# EAGLE design mbhp_core_stm32_v2a (EAGLE 5.00)
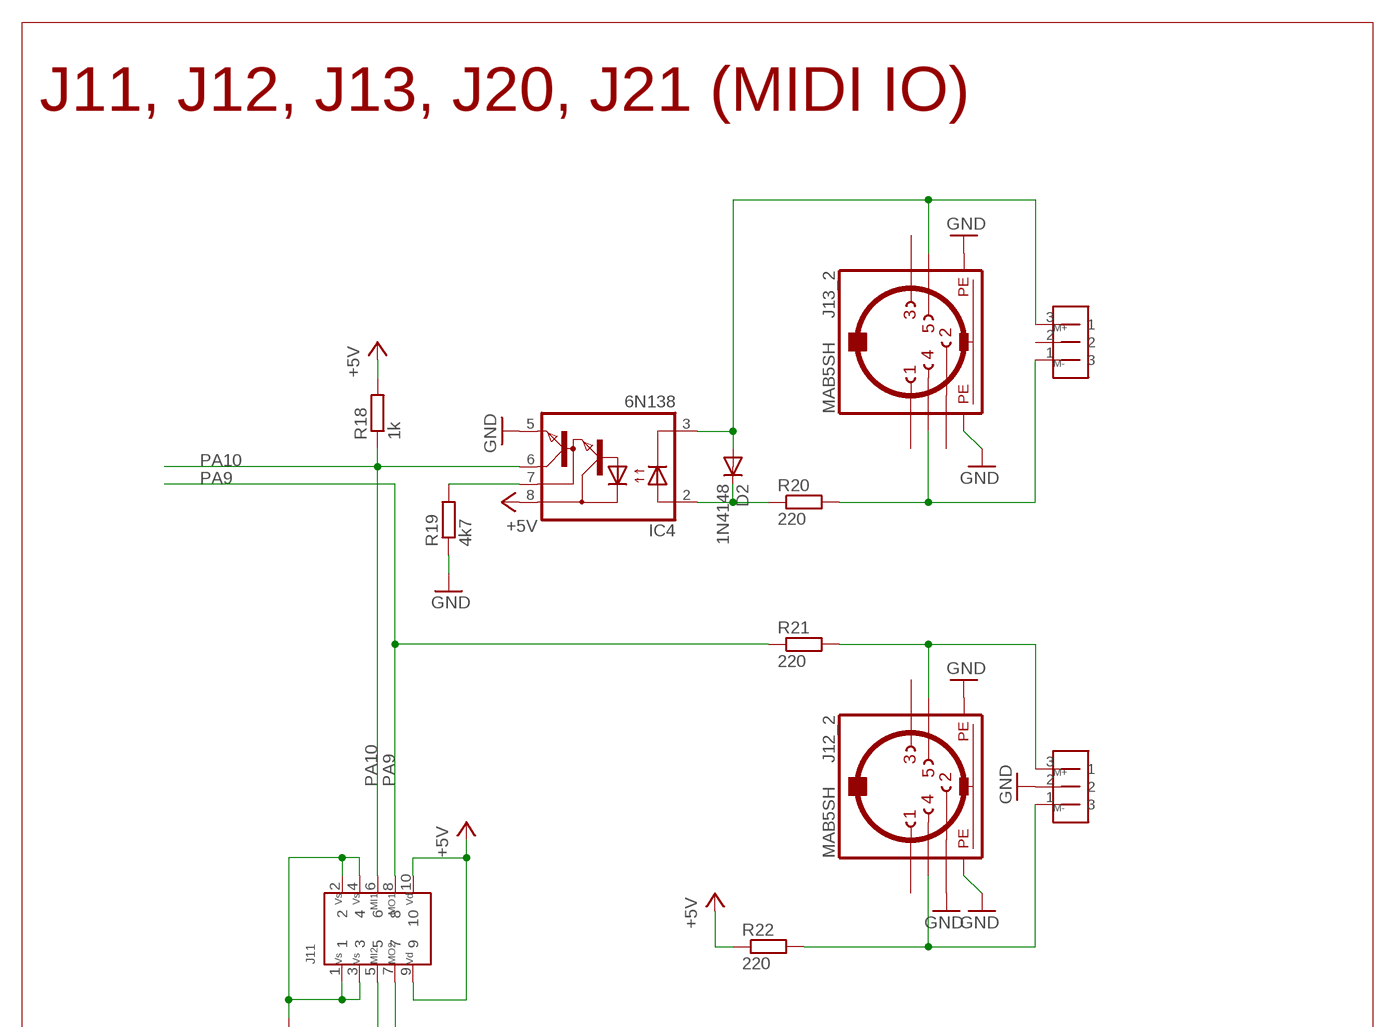
[diagram p0: schematic, sheet 1, part 1 of 3]
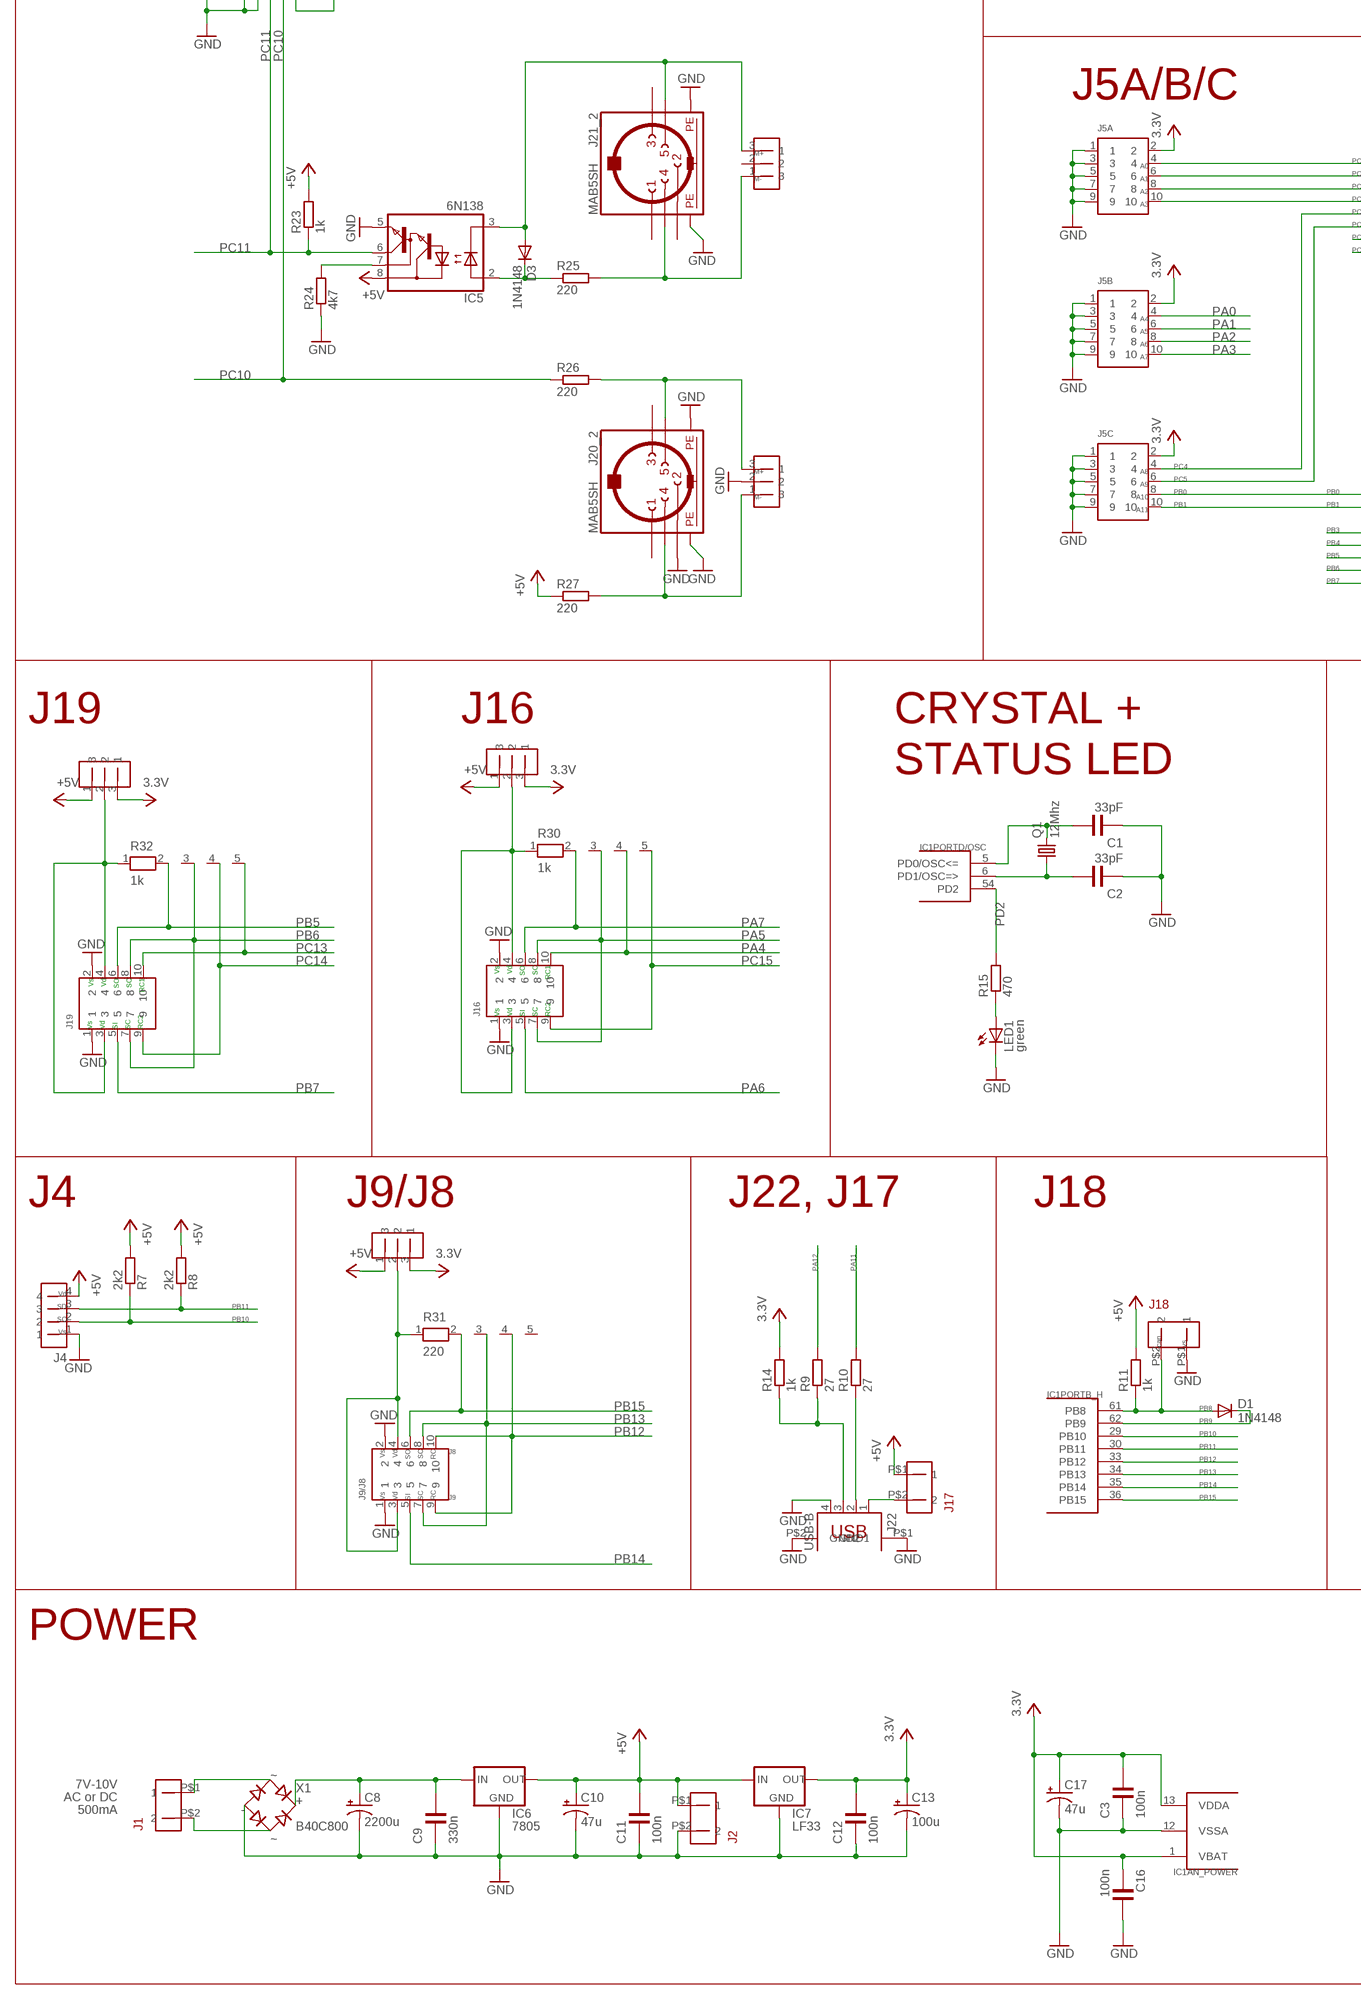
[diagram p1: schematic, sheet 1, part 2 of 3]
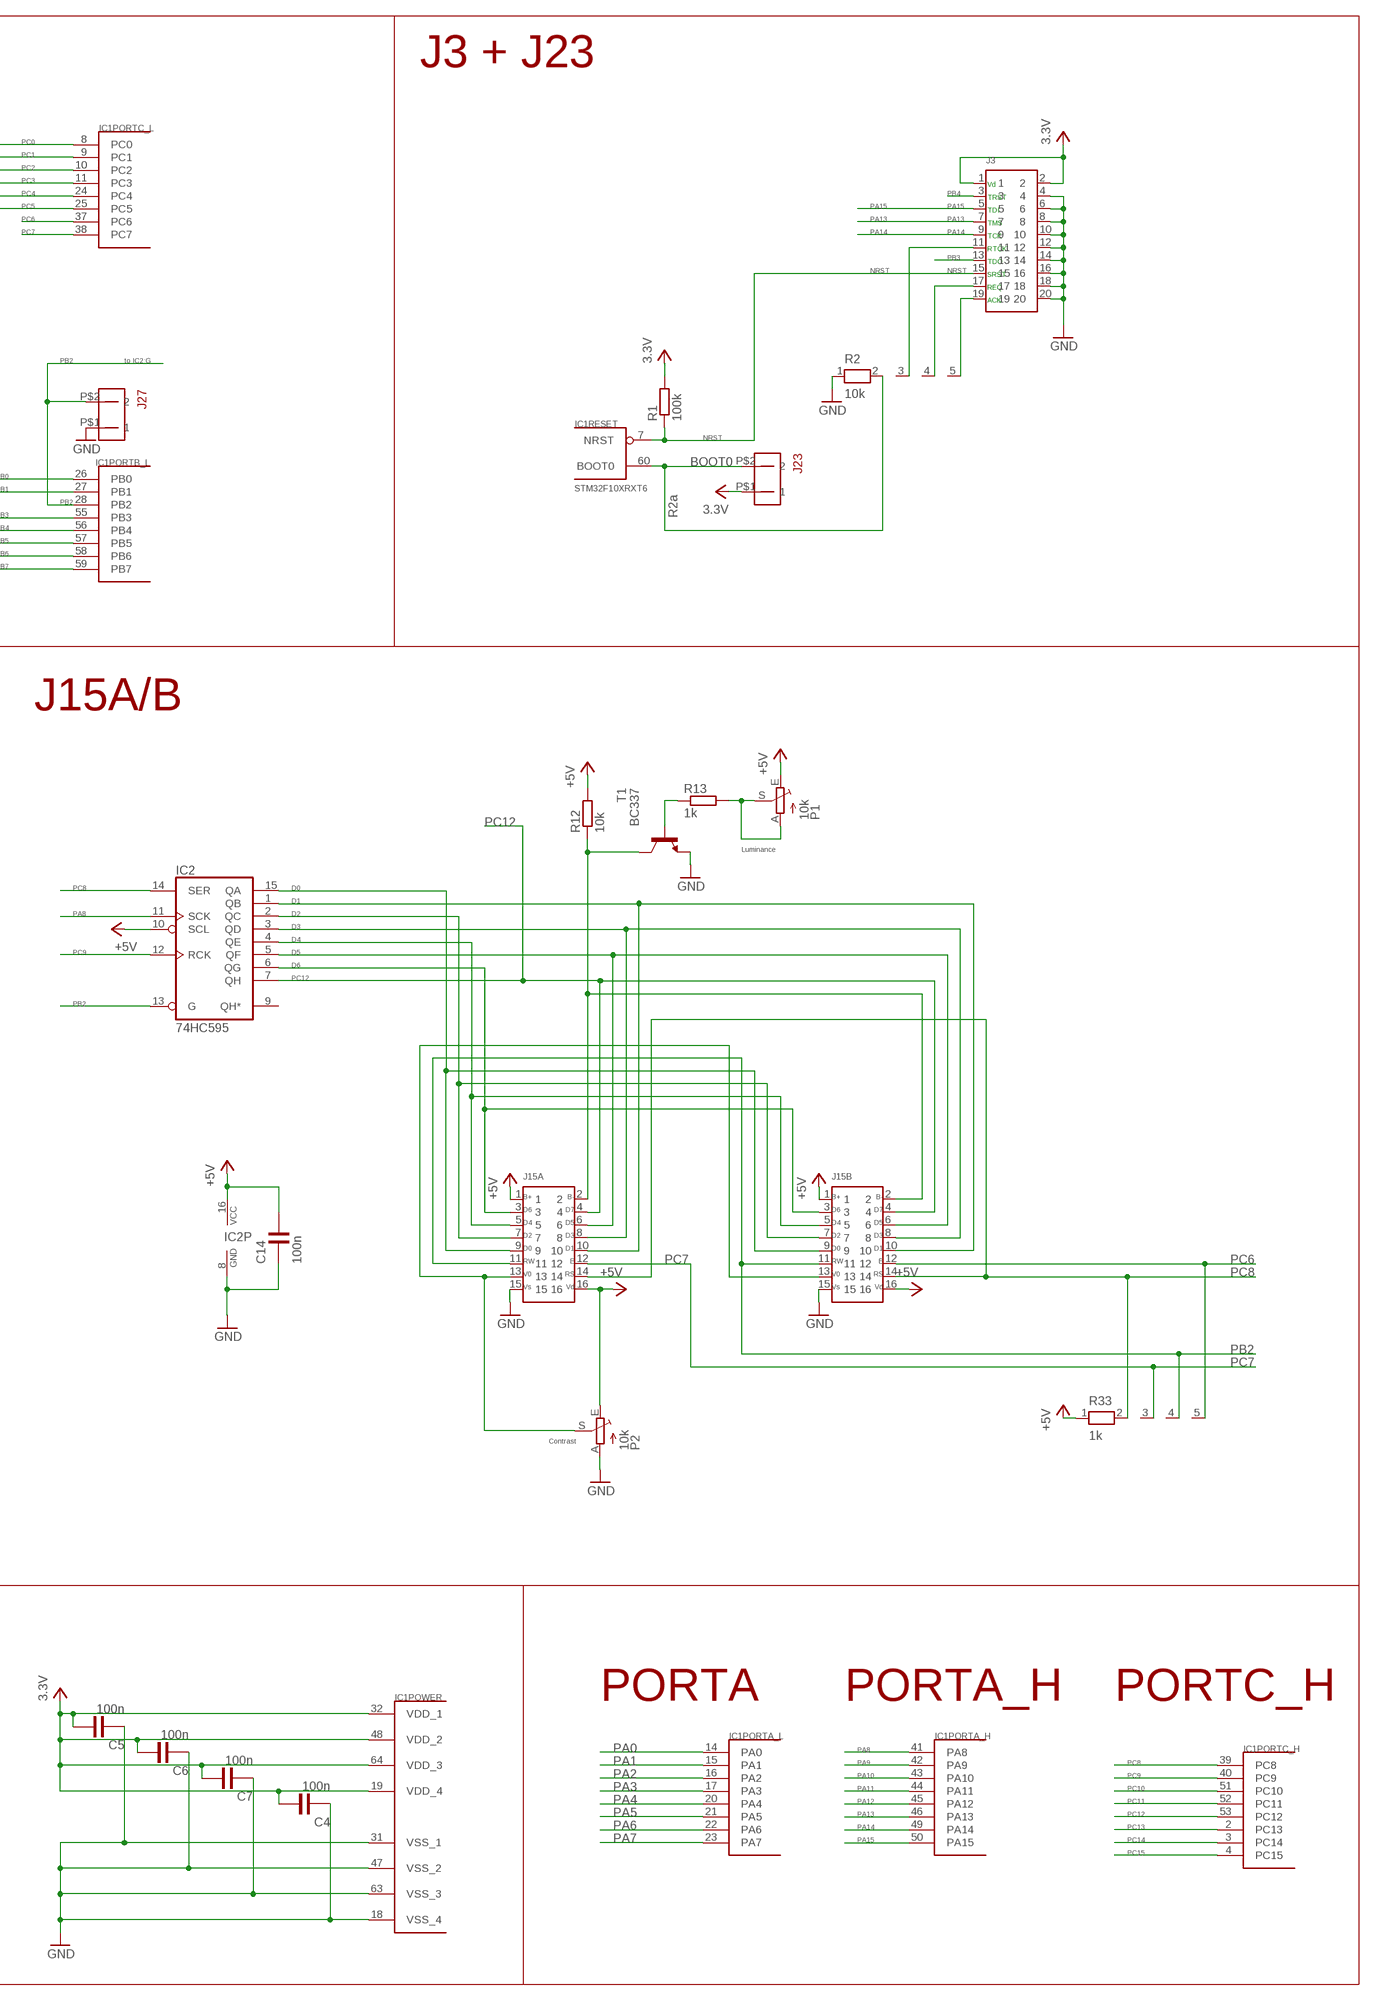
[diagram p2: schematic, sheet 1, part 3 of 3]

## Parts
C1  33pF  C-EU025-024X044  [C025-024X044]
C2  33pF  C-EU025-024X044  [C025-024X044]
C3  100n  C-EU025-025X050  [C025-025X050]
C4  100n  C-EU025-025X050  [C025-025X050]
C5  100n  C-EU025-025X050  [C025-025X050]
C6  100n  C-EU025-025X050  [C025-025X050]
C7  100n  C-EU025-025X050  [C025-025X050]
C8  2200u  CPOL-USE5-13  [E5-13]
C9  330n  C-EU050-025X075  [C050-025X075]
C10  47u  CPOL-USE2.5-7  [E2,5-7]
C11  100n  C-EU025-025X050  [C025-025X050]
C12  100n  C-EU025-025X050  [C025-025X050]
C13  100u  CPOL-USE2.5-7  [E2,5-7]
C14  100n  C-EU025-025X050  [C025-025X050]
C16  100n  C-EU025-025X050  [C025-025X050]
C17  47u  CPOL-USE2.5-6  [E2,5-6]
D1  1N4148  1N4148DIODE_2.5  [D-2.5]
D2  1N4148  1N4148D7  [DIODE_7]
D3  1N4148  1N4148D7  [DIODE_7]
IC1  STM32F10XRXT6  [TQFP64]
IC2  74HC595  74HCT595N  [DIL16]
IC4  6N138  [DIL08]
IC5  6N138  [DIL08]
IC6  7805  78XXS  [78XXS]
IC7  LF33  78XXS  [78XXS]
J1  HEADER1X2  [HEADER1X2]
J2  HEADER1X2  [HEADER1X2]
J3  HEADER2X10  [HEADER2X10]
J4  HEADER1X4  [HEADER1X4]
J5A  HEADER2X5  [HEADER2X5]
J5B  HEADER2X5  [HEADER2X5]
J5C  HEADER2X5  [HEADER2X5]
J9/J8  HEADER2X5  [HEADER2X5]
J11  HEADER2X5  [HEADER2X5]
J12  HEADER1X3  [HEADER1X3]
J12_2  MAB5SH  [MAB5SH]
J13  HEADER1X3  [HEADER1X3]
J13_2  MAB5SH  [MAB5SH]
J15A  HEADER2X8  [HEADER2X8]
J15B  HEADER2X8  [HEADER2X8]
J16  HEADER2X5  [HEADER2X5]
J17  HEADER1X2  [HEADER1X2]
J18  HEADER1X2  [HEADER1X2]
J19  HEADER2X5-SMALL  [HEADER2X5-NO]
J20  HEADER1X3  [HEADER1X3]
J20_2  MAB5SH  [MAB5SH]
J21  HEADER1X3  [HEADER1X3]
J21_2  MAB5SH  [MAB5SH]
J22  USB-B  [PN61729]
J23  HEADER1X2  [HEADER1X2]
J24  HEADER1X3  [HEADER1X3]
J25  HEADER1X3  [HEADER1X3]
J26  HEADER1X3  [HEADER1X3]
J27  HEADER1X2  [HEADER1X2]
LED1  green  LED3MM  [LED3MM]
P1  10k  TRIM_EU-CA6V  [CA6V]
P2  10k  TRIM_EU-CA6V  [CA6V]
Q1  12Mhz  CRYTALHC49S  [HC49/S]
R1  100k  0207/7  [0207/7]
R2  10k  RN04  [RN-5]
R7  2k2  0207/70207/2V  [0207/2V]
R8  2k2  0207/70207/2V  [0207/2V]
R9  27  0207/7  [0207/7]
R10  27  0207/7  [0207/7]
R11  1k  0207/70207/2V  [0207/2V]
R12  10k  0207/70207/2V  [0207/2V]
R13  1k  0207/70207/2V  [0207/2V]
R14  1k  0207/7  [0207/7]
R15  470  0207/70207/2V  [0207/2V]
R18  1k  0207/7  [0207/7]
R19  4k7  0207/7  [0207/7]
R20  220  0207/7  [0207/7]
R21  220  0207/7  [0207/7]
R22  220  0207/7  [0207/7]
R23  1k  0207/7  [0207/7]
R24  4k7  0207/7  [0207/7]
R25  220  0207/7  [0207/7]
R26  220  0207/7  [0207/7]
R27  220  0207/7  [0207/7]
R30  1k  RN04  [RN-5]
R31  220  RN04  [RN-5]
R32  1k  RN04  [RN-5]
R33  1k  RN04  [RN-5]
T1  BC337  [TO92]
X1  B40C800  RB1A  [RB1A]

## Nets
+3.3V: C3.1 C4.1 C5.1 C6.1 C7.1 C12.1 C13.+ C16.2 C17.+ IC1.1(AN_POWER:VBAT) IC1.13(AN_POWER:VDDA) IC1.19(POWER:VDD_4) IC1.32(POWER:VDD_1) IC1.48(POWER:VDD_2) IC1.64(POWER:VDD_3) IC7.OUT J3.1 J3.2 J5A.2 J5B.2 J5C.2 J23.P$1 J24.3 J25.3 J26.3 R1.2 R14.2 ; supply symbol labelled 3.3V
+5V: C10.+ C11.1 C14.1 IC2.10(SCL) IC2.16(VCC) IC4.8(VCC) IC5.8(VCC) IC6.OUT IC7.IN J2.P$1 J4.4 J11.9 J11.10 J15A.1 J15A.16 J15B.1 J15B.16 J17.P$1 J24.1 J25.1 J26.1 P1.E P2.E R7.2 R8.2 R11.2 R12.2 R18.2 R22.1 R23.2 R27.1 R33.1
B-: J15A.2 J15B.2 R12.1 T1.3(C)
BOOT0: IC1.60(RESET:BOOT0) J23.P$2 R2.2
D0: IC2.15(QA) J15A.9 J15B.9
D1: IC2.1(QB) J15A.10 J15B.10
D2: IC2.2(QC) J15A.7 J15B.7
D3: IC2.3(QD) J15A.8 J15B.8
D4: IC2.4(QE) J15A.5 J15B.5
D5: IC2.5(QF) J15A.6 J15B.6
D6: IC2.6(QG) J15A.3 J15B.3
GND: C1.2 C2.2 C3.2 C4.2 C5.2 C6.2 C7.2 C8.- C9.2 C10.- C11.2 C12.2 C13.- C14.2 C16.1 C17.- IC1.12(AN_POWER:VSSA) IC1.18(POWER:VSS_4) IC1.31(POWER:VSS_1) IC1.47(POWER:VSS_2) IC1.63(POWER:VSS_3) IC2.8(GND) IC4.5(GND) IC5.5(GND) IC6.GND IC7.GND J2.P$2 J3.4 J3.6 J3.8 J3.10 J3.12 J3.14 J3.16 J3.18 J3.20 J4.1 J5A.1 J5A.3 J5A.5 J5A.7 J5A.9 J5B.1 J5B.3 J5B.5 J5B.7 J5B.9 J5C.1 J5C.3 J5C.5 J5C.7 J5C.9 J9/J8.1 J9/J8.2 J11.1 J11.2 J11.3 J11.4 J12.2 J12_2.2 J12_2.PE J12_2.PE@(PE) J13_2.PE J13_2.PE@(PE) J15A.15 J15B.15 J16.1 J16.2 J18.P$1 J19.1 J19.2 J20.2 J20_2.2 J20_2.PE J20_2.PE@(PE) J21_2.PE J21_2.PE@(PE) J22.4 J22.P$1(GND1) J22.P$2(GND2) J27.P$1 LED1.K(C) P2.A R2.1 R19.1 R24.1 T1.1(E) X1.-
N$1: LED1.A R15.1
N$2: J16.3 J16.4 J24.2 R30.1
N$3: J19.3 J19.4 J26.2 R32.1
N$4: D2.P$1(A) IC4.3(C) J13.3 J13_2.5
N$5: J9/J8.3 J9/J8.4 J25.2 R31.1
N$7: C8.+ C9.1 IC6.IN X1.+
N$17: J17.P$2 J22.1
N$31: J1.P$1 X1.AC1
N$35: J3.19 R2.5
N$56: J12.1 J12_2.4 R22.2
N$57: J12.3 J12_2.5 R21.2
N$59: IC4.7(VB) R19.2
N$60: J13.1 J13_2.4 R20.2
N$61: D2.P$2(C) IC4.2(A) R20.1
N$62: J1.P$2 X1.AC2
N$64: J20.1 J20_2.4 R27.2
N$65: J20.3 J20_2.5 R26.2
N$67: IC5.7(VB) R24.2
N$68: D3.P$2(C) IC5.2(A) R25.1
N$69: D3.P$1(A) IC5.3(C) J21.3 J21_2.5
N$70: J21.1 J21_2.4 R25.2
N$72: R13.1 T1.2(B)
N$73: P1.A P1.S R13.2
N$74: J15A.13 J15B.13 P2.S
N$83: J3.17 R2.4
N$84: J3.11 R2.3
NRST: IC1.7(RESET:NRST) J3.15 R1.1
PA0: IC1.14(PORTA_L:PA0) J5B.4
PA1: IC1.15(PORTA_L:PA1) J5B.6
PA2: IC1.16(PORTA_L:PA2) J5B.8
PA3: IC1.17(PORTA_L:PA3) J5B.10
PA4: IC1.20(PORTA_L:PA4) J16.10 R30.4
PA5: IC1.21(PORTA_L:PA5) J16.7 J16.8 R30.3
PA6: IC1.22(PORTA_L:PA6) J16.5
PA7: IC1.23(PORTA_L:PA7) J16.6 R30.2
PA8: IC1.41(PORTA_H:PA8) IC2.11(SCK)
PA9: IC1.42(PORTA_H:PA9) J11.8 R21.1
PA10: IC1.43(PORTA_H:PA10) IC4.6(VO) J11.6 R18.1
PA11: IC1.44(PORTA_H:PA11) R10.2
PA12: IC1.45(PORTA_H:PA12) R9.2
PA13: IC1.46(PORTA_H:PA13) J3.7
PA14: IC1.49(PORTA_H:PA14) J3.9
PA15: IC1.50(PORTA_H:PA15) J3.5
PB0: IC1.26(PORTB_L:PB0) J5C.8
PB1: IC1.27(PORTB_L:PB1) J5C.10
PB2: IC1.28(PORTB_L:PB2) IC2.13(G) J15A.11 J15B.11 J27.P$2 R33.4
PB3: IC1.55(PORTB_L:PB3) J3.13
PB4: IC1.56(PORTB_L:PB4) J3.3
PB5: IC1.57(PORTB_L:PB5) J19.6 R32.2
PB6: IC1.58(PORTB_L:PB6) J19.7 J19.8 R32.3
PB7: IC1.59(PORTB_L:PB7) J19.5
PB8: D1.A IC1.61(PORTB_H:PB8) J18.P$2 R11.1
PB9: D1.C IC1.62(PORTB_H:PB9)
PB10: IC1.29(PORTB_H:PB10) J4.2 R7.1
PB11: IC1.30(PORTB_H:PB11) J4.3 R8.1
PB12: IC1.33(PORTB_H:PB12) J9/J8.9 J9/J8.10 R31.4
PB13: IC1.34(PORTB_H:PB13) J9/J8.7 J9/J8.8 R31.3
PB14: IC1.35(PORTB_H:PB14) J9/J8.5
PB15: IC1.36(PORTB_H:PB15) J9/J8.6 R31.2
PC0: IC1.8(PORTC_L:PC0) J5A.4
PC1: IC1.9(PORTC_L:PC1) J5A.6
PC2: IC1.10(PORTC_L:PC2) J5A.8
PC3: IC1.11(PORTC_L:PC3) J5A.10
PC4: IC1.24(PORTC_L:PC4) J5C.4
PC5: IC1.25(PORTC_L:PC5) J5C.6
PC6: IC1.37(PORTC_L:PC6) J15B.12 R33.5
PC7: IC1.38(PORTC_L:PC7) J15A.12 R33.3
PC8: IC1.39(PORTC_H:PC8) IC2.14(SER) J15A.14 J15B.14 R33.2
PC9: IC1.40(PORTC_H:PC9) IC2.12(RCK)
PC10: IC1.51(PORTC_H:PC10) J11.7 R26.1
PC11: IC1.52(PORTC_H:PC11) IC5.6(VO) J11.5 R23.1
PC12: IC1.53(PORTC_H:PC12) IC2.7(QH) J15A.4 J15B.4
PC13: IC1.2(PORTC_H:PC13) J19.10 R32.5
PC14: IC1.3(PORTC_H:PC14) J19.9 R32.4
PC15: IC1.4(PORTC_H:PC15) J16.9 R30.5
PD0: C1.1 IC1.5(PORTD/OSC:PD0/OSC<=) Q1.2
PD1: C2.1 IC1.6(PORTD/OSC:PD1/OSC=>) Q1.1
PD2: IC1.54(PORTD/OSC:PD2) R15.2
USB1: J22.2 R10.1
USB2: J22.3 R9.1 R14.1
Unconnected: IC2.9(QH*) J12_2.1 J12_2.3 J13.2 J13_2.1 J13_2.2 J13_2.3 J20_2.1 J20_2.3 J21.2 J21_2.1 J21_2.2 J21_2.3 R31.5

## Notes on the sheet
- J11, J12, J13, J20, J21 (MIDI IO)
- M+
- M-
- M+
- M-
- Vs | Vs | MI1 | MO1 | Vd
- Vs | Vs | MI2 | MO2 | Vd
- J5A/B/C | J3 + J23
- M+
- A0
- M- | A1
- A2
- A3
- Vd
- TRST
- TDI
- TMS
- TCK
- RTCK
- TDO
- SRST
- REQ
- A4
- ACK
- A5
- A6
- A7
- to IC2:G
- M+ | A8
- A9
- M- | A10
- A11
- R2a
- J19 | J16 | CRYSTAL + | J15A/B
- STATUS LED
- Luminance
- Vs | Vd | SO | SC | RC1
- Vs | Vd | SO | SC | RC1
- Vs | Vd | SI | SC | RC2
- Vs | Vd | SI | SC | RC2
- B- | B-
- J4 | J9/J8 | J22, J17 | J18 | B+ | B+
- D7 | D7
- D6 | D6
- D5 | D5
- D4 | D4
- D3 | D3
- D2 | D2
- D1 | D1
- D0 | D0
- E | E
- RW | RW
- RS | RS
- V0 | V0
- Vd | Vd
- Vd | Vs | Vs
- SD
- SC
- Vs
- can | vs
- Vs | Vd | SO | SC | RC | Contrast
- J8
- Vs | Vd | SI | SC | RC | J9
- POWER
- PORTA | PORTA_H | PORTC_H
- 7V-10V | ~
- AC or DC
- 500mA | - | +
- ~

## Library data of the parts
C1-C7 C9 C11 C12 C14 C16 = rcl:C-EU: CAPACITOR, European symbol
C8 C10 C13 C17 = rcl:CPOL-US: POLARIZED CAPACITOR, American symbol
D1-D3 = diode:1N4148: DIODE high speed (Philips)
IC1 = stm32:STM32F10XRXT6: STM32F101/103 64pin LQFP
IC2 = 74xx-eu:74*595: 8-bit SHIFT REGISTER, output latch
IC4 IC5 = optocoupler:6N138: MOTOROLA OPTO COUPLER
IC6 IC7 = v-reg:78XXS: VOLTAGE REGULATOR
J1 J2 J17 J18 J23 J27 = nILS:HEADER1X2
J3 = nILS:HEADER2X10
J4 = nILS:HEADER1X4
J5A J5B J5C J9/J8 J11 J16 J19 = nILS:HEADER2X5
J12 J13 J20 J21 J24-J26 = nILS:HEADER1X3
J12_2 J13_2 J20_2 J21_2 = con-hirschmann:MAB5SH: Female CONNECTOR 5 pins 90 deg. with shield, horizontal (DIN 41524)
J15A J15B = nILS:HEADER2X8
J22 = con-berg:USB-B
LED1 = led:LED: LED OSRAM: - CHIPLED LG R971, LG N971, LY N971, LG Q971, LY Q971, LO R971, LY R971 LH N974, LH R974 LS Q976, LO Q976, LY Q976 LO Q996 - Hyper CHIPLED LW Q18S LB Q993, LB Q99A, LB R99A - SideLED LS A670, LO A670, LY A670, LG A670, LP A670 LB A673, LV A673, LT A673, LW A673 LH A674 LY A675 LS A676, LA A676, LO A676, LY A676, LW A676 LS A679, LY A679, LG A679 - Hyper Micro SIDELED® LS Y876, LA Y876, LO Y876, LY Y876 LT Y87S - SmartLED LW L88C, LW L88S LB L89C, LB L89S, LG L890 LS L89K, LO L89K, LY L89K LS L896, LA L896, LO L896, LY L896 - TOPLED LS T670, LO T670, LY T670, LG T670, LP T670 LSG T670, LSP T670, LSY T670, LOP T670, LYG T670 LG T671, LOG T671, LSG T671 LB T673, LV T673, LT T673, LW T673 LH T674 LS T676, LA T676, LO T676, LY T676, LB T676, LH T676, LSB T676, LW T676 LB T67C, LV T67C, LT T67C, LS T67K, LO T67K, LY T67K, LW E67C LS E67B, LA E67B, LO E67B, LY E67B, LB E67C, LV E67C, LT E67C LW T67C LS T679, LY T679, LG T679 LS T770, LO T770, LY T770, LG T770, LP T770 LB T773, LV T773, LT T773, LW T773 LH T774 LS E675, LA E675, LY E675, LS T675 LS T776, LA T776, LO T776, LY T776, LB T776 LHGB T686 LT T68C, LB T68C - Hyper Mini TOPLED® LB M676 - Mini TOPLED Santana® LG M470 LS M47K, LO M47K, LY M47K Source: http://www.osram.convergy.de/
P1 P2 = pot:TRIM_EU-: POTENTIOMETER
Q1 = crystal:CRYTAL: CRYSTAL
R1 R7-R15 R18-R27 = midibox:0207/7
R2 R30-R33 = resistor-net:RN04: RESISTOR NETWORK
T1 = transistor:BC337: NPN TRANSISTOR
X1 = rectifier:RB1A: RECTIFIER 1 A

## Board
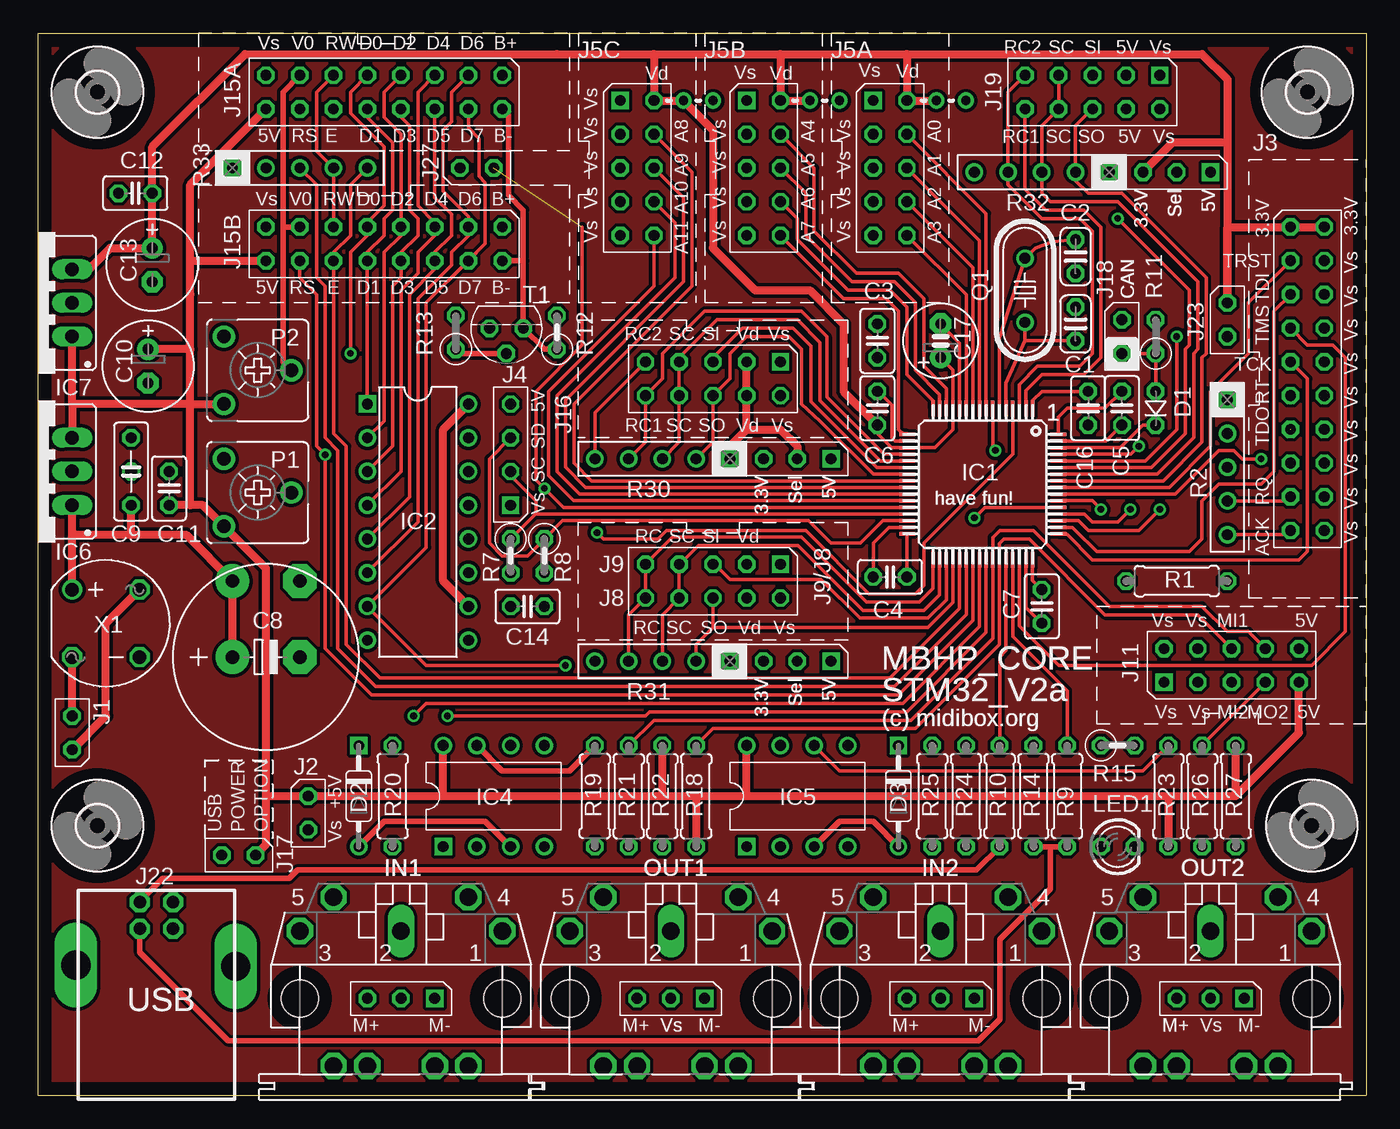
[diagram p3: board, top side]
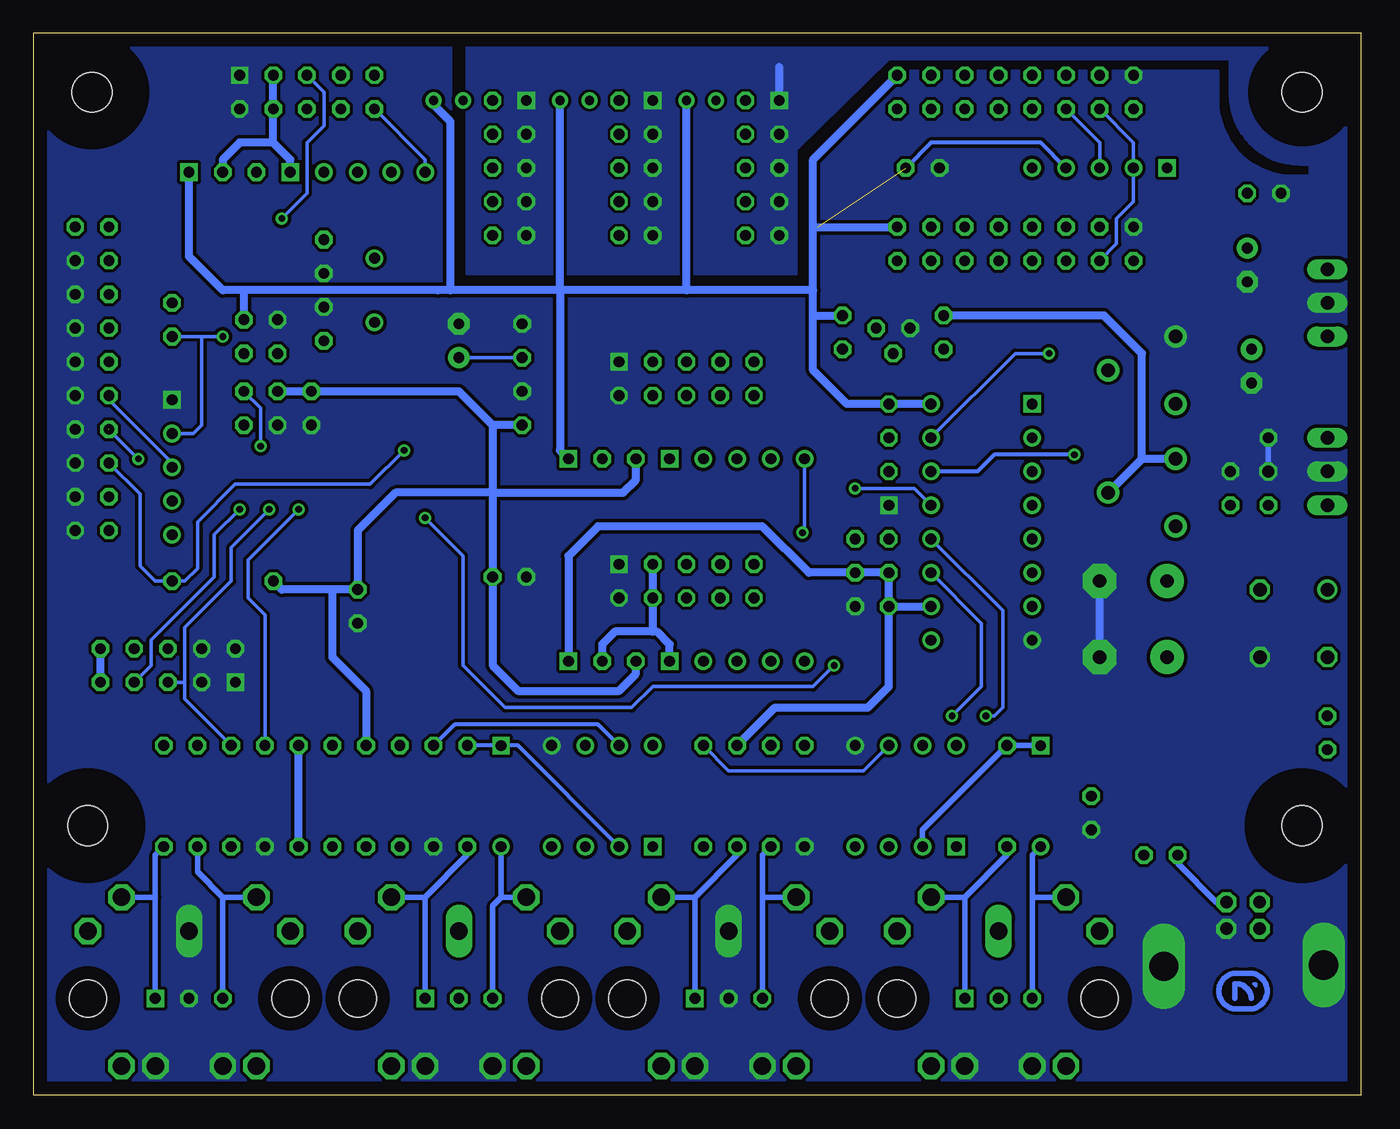
[diagram p4: board, bottom side, seen from below]

Size 100 x 80 mm. Coordinates in mm from the lower left corner, seen from the top.
Outline: 0,0 0,80 100,80 100,0 0,0
Copper layers (1*16): Top 0.035mm / dielectric 1.5mm / Bottom 0.035mm
Design rules "default": minimum track width 10mil, minimum drill 18mil, track to track 8mil, track to pad 8mil, pad to pad 8mil, via to via 8mil, smd to smd 8mil, copper to edge 40mil, drill to drill 8mil, minimum pad ring 10mil, minimum via ring 8mil, stop-mask expansion 4mil, vias tented up to drill 0mil, thermal gap 10mil

### Footprints (pad centres in the part's own frame; a part is rotated, then mirrored left to right if it is on the bottom)
C025-024X044 = drill 0.813 octagon: 1 -1.27,0; 2 1.27,0
C025-025X050 = drill 0.813 octagon: 1 -1.27,0; 2 1.27,0
E5-13 = drill 1.016 pad 2.54 round: + -2.54,0 | drill 1.016 pad 2.54 octagon: - 2.54,0
C050-025X075 = drill 0.813 octagon: 1 -2.54,0; 2 2.54,0
E2,5-7 = drill 0.813 pad 1.6 round: + -1.27,0 | drill 0.813 pad 1.6 octagon: - 1.27,0
E2,5-6 = drill 0.813 pad 1.6 round: + -1.27,0 | drill 0.813 pad 1.6 octagon: - 1.27,0
D-2.5 = drill 0.813 octagon: A 1.27,0; C -1.27,0
DIODE_7 = drill 0.8 round: P$1 -3.81,0 | drill 0.8 square: P$2 3.81,0
TQFP64 = smd 1.194 x 0.254: 1 -5.7,3.75; 2 -5.7,3.25; 3 -5.7,2.75; 4 -5.7,2.25; 5 -5.7,1.75; 6 -5.7,1.25; 7 -5.7,0.75; 8 -5.7,0.25; 9 -5.7,-0.25; 10 -5.7,-0.75; 11 -5.7,-1.25; 12 -5.7,-1.75; 13 -5.7,-2.25; 14 -5.7,-2.75; 15 -5.7,-3.25; 16 -5.7,-3.75; 33 5.7,-3.75; 34 5.7,-3.25; 35 5.7,-2.75; 36 5.7,-2.25; 37 5.7,-1.75; 38 5.7,-1.25; 39 5.7,-0.75; 40 5.7,-0.25; 41 5.7,0.25; 42 5.7,0.75; 43 5.7,1.25; 44 5.7,1.75; 45 5.7,2.25; 46 5.7,2.75; 47 5.7,3.25; 48 5.7,3.75 | smd 0.254 x 1.194: 17 -3.75,-5.7; 18 -3.25,-5.7; 19 -2.75,-5.7; 20 -2.25,-5.7; 21 -1.75,-5.7; 22 -1.25,-5.7; 23 -0.75,-5.7; 24 -0.25,-5.7; 25 0.25,-5.7; 26 0.75,-5.7; 27 1.25,-5.7; 28 1.75,-5.7; 29 2.25,-5.7; 30 2.75,-5.7; 31 3.25,-5.7; 32 3.75,-5.7; 49 3.75,5.7; 50 3.25,5.7; 51 2.75,5.7; 52 2.25,5.7; 53 1.75,5.7; 54 1.25,5.7; 55 0.75,5.7; 56 0.25,5.7; 57 -0.25,5.7; 58 -0.75,5.7; 59 -1.25,5.7; 60 -1.75,5.7; 61 -2.25,5.7; 62 -2.75,5.7; 63 -3.25,5.7; 64 -3.75,5.7
DIL16 = drill 0.813 square: 1 -8.89,-3.81 | drill 0.813 round: 2 -6.35,-3.81; 3 -3.81,-3.81; 4 -1.27,-3.81; 5 1.27,-3.81; 6 3.81,-3.81; 7 6.35,-3.81; 8 8.89,-3.81; 9 8.89,3.81; 10 6.35,3.81; 11 3.81,3.81; 12 1.27,3.81; 13 -1.27,3.81; 14 -3.81,3.81; 15 -6.35,3.81; 16 -8.89,3.81
DIL08 = drill 0.813 square: 1 -3.81,-3.81 | drill 0.813 round: 2 -1.27,-3.81; 3 1.27,-3.81; 4 3.81,-3.81; 5 3.81,3.81; 6 1.27,3.81; 7 -1.27,3.81; 8 -3.81,3.81
78XXS = drill 1.016 long: GND 0,-2.54; IN -2.54,-2.54; OUT 2.54,-2.54
HEADER1X2 = drill 0.813 octagon: P$1 0,1.27; P$2 0,-1.27
HEADER2X10 = drill 0.8 octagon: 1 -1.268,11.434; 2 1.272,11.434; 3 -1.268,8.894; 4 1.272,8.894; 5 -1.268,6.354; 6 1.272,6.354; 7 -1.268,3.814; 8 1.272,3.814; 9 -1.268,1.274; 10 1.272,1.274; 11 -1.268,-1.266; 12 1.272,-1.266; 13 -1.268,-3.806; 14 1.272,-3.806; 15 -1.268,-6.346; 16 1.272,-6.346; 17 -1.268,-8.886; 18 1.272,-8.886; 19 -1.268,-11.426; 20 1.272,-11.426
HEADER1X4 = drill 0.8 square: 1 0,5.08 | drill 0.8 octagon: 2 0,2.54; 3 0,0; 4 0,-2.54
HEADER2X5 = drill 0.8 square: 1 -1.27,5.08 | drill 0.8 octagon: 2 1.27,5.08; 3 -1.27,2.54; 4 1.27,2.54; 5 -1.27,0; 6 1.27,0; 7 -1.27,-2.54; 8 1.27,-2.54; 9 -1.27,-5.08; 10 1.27,-5.08
HEADER1X3 = drill 0.813 square: 1 0,2.54 | drill 0.813 octagon: 2 0,0; 3 0,-2.54
MAB5SH = drill 1.321 octagon: 1 7.62,5.08; 3 -7.62,5.08; 4 5.08,7.62; 5 -5.08,7.62; PE -2.54,-5.08; PE1 -5.08,-5.08; PE2 5.08,-5.08; PE@ 2.54,-5.08 | drill 1.321 long: 2 0,5.08 | hole 2.794: 7.62,0; -7.62,0
HEADER2X8 = drill 0.8 octagon: 1 -1.27,8.89; 2 1.27,8.89; 3 -1.27,6.35; 4 1.27,6.35; 5 -1.27,3.81; 6 1.27,3.81; 7 -1.27,1.27; 8 1.27,1.27; 9 -1.27,-1.27; 10 1.27,-1.27; 11 -1.27,-3.81; 12 1.27,-3.81; 13 -1.27,-6.35; 14 1.27,-6.35; 15 -1.27,-8.89; 16 1.27,-8.89
HEADER2X5-NO = drill 0.8 square: 1 -1.27,5.08 | drill 0.8 octagon: 2 1.27,5.08; 3 -1.27,2.54; 4 1.27,2.54; 5 -1.27,0; 6 1.27,0; 7 -1.27,-2.54; 8 1.27,-2.54; 9 -1.27,-5.08; 10 1.27,-5.08
PN61729 = drill 0.95 pad 1.5 octagon: 1 1.25,4.71; 2 -1.25,4.71; 3 -1.25,2.71; 4 1.25,2.71 | drill 2.2 pad 2.54 long: P$1 -6.067,-0.018; P$2 5.973,-0.12
LED3MM = drill 0.813 octagon: A -1.27,0; K 1.27,0
CA6V = drill 1.016 pad 1.676 round: A -2.54,-2.54; E 2.54,-2.54; S 0,2.54
HC49/S = drill 0.813 round: 1 -2.413,0; 2 2.413,0
0207/7 = drill 0.813 octagon: 1 -3.81,0; 2 3.81,0
RN-5 = drill 0.813 square: 1 -5.08,0 | drill 0.813 round: 2 -2.54,0; 3 0,0; 4 2.54,0; 5 5.08,0
0207/2V = drill 0.813 octagon: 1 -1.27,0; 2 1.27,0
TO92 = drill 0.813 octagon: 1 1.27,0; 2 0,1.905; 3 -1.27,0
3,0 = hole 3: 0,0
RB1A = drill 1.016 round: + -2.54,2.54 | drill 1.016 octagon: - 2.54,-2.54; AC1 2.54,2.54; AC2 -2.54,-2.54

### Placement (x,y rotation side)
C1  78.11,58.1 90 top
C2  78.11,63.18 270 top
C3  63.18,56.83 90 top
C4  64.14,39.05 180 top
C5  81.6,51.75 270 top
C6  63.18,51.75 90 top
C7  75.56,36.83 270 top
C8  17.14,33.02 0 top
C9  6.99,46.99 90 top
C10  8.26,54.93 270 top
C11  9.84,45.72 90 top
C12  7.3,67.94 180 top
C13  8.57,62.55 270 top
C14  36.83,36.83 0 top
C16  79.06,51.75 90 top
C17  67.94,56.83 90 top
D1  84.14,51.75 90 top
D2  24.13,22.54 90 top
D3  64.77,22.54 90 top
IC1  71.12,46.04 270 top
IC2  28.57,43.18 270 top
IC4  34.29,22.54 0 top
IC5  57.15,22.54 0 top
IC6  0,46.99 90 top
IC7  0,59.69 90 top
J1  2.54,27.3 180 top
J2  20.32,21.27 0 top
J3  95.57,53.98 0 top
J4  35.56,49.53 180 top
J5A  64.14,69.85 0 top
J5B  54.61,69.85 0 top
J5C  45.09,69.85 0 top
J9/J8  50.8,38.73 270 top
J11  89.85,32.38 90 top
J12  47.62,7.3 270 top
J12_2  47.62,7.3 0 top
J13  27.3,7.3 270 top
J13_2  27.3,7.3 0 top
J15A  26.04,75.56 270 top
J15B  26.04,64.14 270 top
J16  50.8,53.98 270 top
J17  15.08,18.1 270 top
J18  81.6,57.15 0 top
J19  79.38,75.56 270 top
J20  88.27,7.3 270 top
J20_2  88.27,7.3 0 top
J21  67.94,7.3 270 top
J21_2  67.94,7.3 0 top
J22  8.89,9.84 0 top
J23  89.53,58.42 0 top
J24  57.15,47.94 270 top
J25  57.15,32.7 270 top
J26  85.72,69.53 270 top
J27  33.02,69.85 90 top
LED1  81.28,18.73 0 top
P1  16.51,45.4 270 top
P2  16.51,54.61 270 top
Q1  74.3,60.64 270 top
R1  85.72,38.73 180 top
R2  89.53,47.31 270 top
R7  35.56,40.64 270 top
R8  38.1,40.64 270 top
R9  77.47,22.54 90 top
R10  72.39,22.54 90 top
R11  84.14,57.15 90 top
R12  39.05,57.47 90 top
R13  31.43,57.47 90 top
R14  74.93,22.54 90 top
R15  81.28,26.35 0 top
R18  49.53,22.54 270 top
R19  41.91,22.54 90 top
R20  26.67,22.54 270 top
R21  44.45,22.54 270 top
R22  46.99,22.54 270 top
R23  85.09,22.54 270 top
R24  69.85,22.54 90 top
R25  67.31,22.54 270 top
R26  87.63,22.54 270 top
R27  90.17,22.54 270 top
R30  46.99,47.94 180 top
R31  46.99,32.7 180 top
R32  75.56,69.53 180 top
R33  19.68,69.85 0 top
T1  35.24,57.78 180 top
U$1  [3,0]  95.57,75.56 0 top
U$3  [3,0]  4.45,75.56 0 top
U$4  [3,0]  4.45,20.32 0 top
U$5  [3,0]  95.89,20.32 0 top
X1  5.08,35.56 0 top

### Tracks (layer width: path | path; a pad name or v marks a point on that pad's centre or on a via)
+3.3V  (via drill 0.7 pad 1.22)
  Top 0.254: IC1.48 74.87,38.8 C7.1 | C17.+ 68.87,54.64 IC1.13 68.87,50.14 67.52,48.79 IC1.19 64.24,48.79 63.25,49.78 63.25,50.48 C6.1 | IC1.32 65.41,42.27 C4.1 | IC1.1 74.87,52.33 75.56,53.02 C16.2 | IC1.64 76.82,51.1 77.47,51.75 80.33,51.75 C5.1
  Top 0.61: IC7.OUT 3.81,62.23 5.4,63.82 C13.+ C12.1 8.57,71.44 15.56,78.42 39.05,78.42 46.35,78.42 | 55.88,78.42 J5B.2 v58.1,74.93 | 55.88,78.42 65.41,78.42 | 65.41,78.42 J5A.2 v67.63,74.93 | 65.41,78.42 87.63,78.42 89.53,76.52 89.53,71.75 | 89.53,71.75 J23.P$1 89.54,65.41 J3.1 | J3.1 | J3.2 J3.1 | 89.53,71.75 85.41,71.75 J26.3 | 46.35,78.42 55.88,78.42 | 46.35,78.42 J5C.2 | J5C.2 v48.58,74.93 | v48.58,74.93 50.8,72.71 50.8,63.82 53.98,60.64 58.1,60.64 60.64,58.1 60.64,53.02 C6.1 | J5C.2 v48.58,74.93
  Bottom 0.254: C17.+ C3.1
  Bottom 0.61: C7.1 81.28,38.1 R1.2 | C16.2 C5.1 C16.2 | C7.1 75.56,38.73 | C4.1 65.41,38.42 | C4.1 65.41,32.38 63.5,30.48 55.88,30.48 54.61,31.75 J25.3 | J24.3 54.61,46.35 55.56,45.4 65.41,45.4 | 65.41,45.4 C4.1 | 65.41,50.48 65.41,45.4 | C6.1 65.41,50.48 | 65.41,50.48 67.94,53.02 C16.2 | C7.1 75.56,42.55 72.71,45.4 65.41,45.4 | C7.1 77.47,38.1 77.47,33.02 74.93,30.48 R14.2
+5V  (via drill 0.7 pad 1.22)
  Top 0.61: 14.61,71.75 J15A.16 | 11.43,60.33 11.43,62.87 J15B.16 | 30.48,22.54 46.99,22.54 | 46.99,22.54 49.53,22.54 | 49.53,22.54 53.34,22.54 | J17.P$1 17.14,18.89 17.14,22.54 | 30.48,22.54 IC4.8 | 46.99,22.54 R22.1 | 49.53,22.54 R18.2 | 53.34,22.54 85.09,22.54 | 85.09,22.54 90.17,22.54 | 90.17,22.54 R27.1 | 11.43,52.07 P2.E | IC2.10 30.48,38.73 30.48,50.16 IC2.16 | 20,22.54 30.48,22.54 | 17.14,22.54 20,22.54 | 20,22.54 J2.P$1 | 17.14,22.54 17.14,39.69 P1.E 12.38,44.45 11.43,44.45 | 11.43,60.33 11.43,68.58 14.61,71.75 | 14.61,71.75 13.65,70.8 R33.1 | 11.43,44.45 11.43,52.07 | 11.43,52.07 11.43,56.2 | 11.43,56.2 11.43,60.33 | 11.43,52.07 2.54,52.07 | 2.54,52.07 IC6.OUT | 2.54,52.07 IC7.IN | 11.43,56.2 C10.+ | J11.9 94.93,27.3 90.17,22.54 | 85.09,22.54 R23.2 | 11.43,44.45 C11.1 | 53.34,22.54 IC5.8
  Bottom 0.61: J15A.1 41.27,70.48 41.27,60.64 | C14.1 IC2.10 32.07,36.83 | IC2.16 J4.4 38.73,52.07 41.27,54.61 41.27,58.74 | 41.27,60.64 41.27,65.41 J15B.1 | R7.2 R8.2 R7.2 | C14.1 R7.2 | C14.1 35.56,30.8 37.15,29.21 44.13,29.21 R22.1 | 41.27,58.74 R12.2 | 60.33,60.64 60.33,48.58 J24.1 | 41.27,58.74 41.27,60.64 | J25.1 59.69,40.64 57.47,42.86 45.09,42.86 41.59,39.37 R7.2 | J26.1 88.27,63.18 85.72,60.64 84.14,60.64 | 68.58,60.64 84.14,60.64 | 84.14,60.64 R11.2 | J11.9 J11.10 | 60.33,60.64 68.58,60.64 | 68.58,60.64 69.53,60.64 | 68.58,60.64 68.58,73.34 69.85,74.61 v69.85,74.93 | 50.8,60.64 60.33,60.64 | 60.33,60.64 v60.33,74.93 | 50.8,60.64 v50.8,74.93 | 41.27,60.64 50.8,60.64
B-
  Top 0.406: 36.51,62.87 T1.3 38.1,56.2 R12.1 | 36.51,62.87 J15B.2 | 36.51,62.87 36.51,66.67 35.4,67.79 35.4,73.82 J15A.2
BOOT0  (via drill 0.5)
  Top 0.254: IC1.60 83.35,47.79 85.72,50.16 v85.72,57.15
  Bottom 0.254: v85.72,57.15 87.31,57.15 | 87.31,57.15 J23.P$2 | R2.2 87.95,49.85 87.31,50.48 87.31,57.15
D0  (via drill 0.5)
  Top 0.254: J15A.9 23.5,75.56 23.5,73.98 26.04,71.44 26.04,66.99 24.77,65.72 J15B.9 24.77,64.77 23.5,63.5 v23.5,55.88
  Bottom 0.254: v23.5,55.88 26.04,55.88 IC2.15
D1
  Top 0.254: IC2.1 J15B.10 24.77,63.5 26.04,64.77 26.04,66.04 26.67,66.67 26.67,71.75 24.77,73.66 J15A.10
D2
  Top 0.254: IC2.2 26.04,50.8 26.04,63.5 27.3,64.77 J15B.7 27.3,72.39 26.04,73.66 26.04,75.56 J15A.7
D3
  Top 0.254: IC2.3 26.67,48.9 26.67,60.96 27.3,61.59 J15B.8 27.3,63.5 28.57,64.77 28.57,66.04 27.94,66.67 27.94,73.03 27.3,73.66 J15A.8
D4
  Top 0.254: IC2.4 27.3,46.99 27.3,60.64 28.57,61.91 28.57,63.5 29.84,64.77 J15B.5 29.84,65.72 28.57,66.99 28.57,75.56 J15A.5
D5
  Top 0.254: IC2.5 27.94,45.09 27.94,60.33 29.84,62.23 J15B.6 29.84,63.5 31.11,64.77 31.11,66.36 29.84,67.63 29.84,69.53 J15A.6
D6
  Top 0.254: IC2.6 28.57,43.18 28.57,60.01 31.11,62.55 31.11,63.5 32.38,64.77 32.38,66.04 | J15A.3 31.11,75.56 31.11,73.34 30.48,72.71 30.48,68.1 32.38,66.2 32.38,66.04 | 32.38,66.04 J15B.3
GND  (via drill 0.9 pad 0.25, 1 pad 2.54)
  Top 0.254: IC1.47 74.37,36.76 C7.2 | C4.2 62.87,41.59 64.06,42.79 IC1.31 | IC1.63 80.4,49.29 C5.2 | IC1.18 64.5,49.29 64.26,49.53 64.26,52.01 63.25,53.02 C6.2 | IC1.12 69.37,56.68 C17.-
  Bottom 0.406: v6.99,46.99 C9.2
  Bottom 0.61: C8.- v19.68,38.73 | J5C.1 43.81,77.47
  pour Bottom (isolate 0.254, no thermals): 10.79,77.15 41.27,77.15 41.27,60.64 68.58,60.64 68.58,80.01 100.01,80.01 100.01,0 0,0 0,69.22 5.08,69.22 arc90 10.79,74.93
  pour Bottom (no thermals): 0,80.01 67.31,80.01 67.31,61.91 42.55,61.91 42.55,71.28 35.56,78.11 9.84,78.11 9.84,75.41 arc-90 4.6,70.17 3.81,70.17 3.81,69.22 0,69.22
N$1
  Bottom 0.61: LED1.A R15.1
N$2
  Top 0.61: J16.3 J16.4 53.34,50.16 | R30.1 52.07,48.9 53.34,50.16 | J24.2 57.15,48.9 55.88,50.16 53.34,50.16
N$3
  Bottom 0.61: R32.1 80.64,70.48 81.92,71.75 | 81.92,71.75 J19.4 J19.3 | J26.2 85.72,70.48 84.45,71.75 81.92,71.75
N$4
  Top 0.406: D2.P$1 26.04,20.64 33.66,20.64 IC4.3
  Bottom 0.406: J13.3 24.77,14.92 | 24.77,14.92 J13_2.5 | 24.77,14.92 24.77,18.1 D2.P$1
N$5
  Bottom 0.61: J9/J8.3 J9/J8.4 53.34,34.92 | J25.2 57.15,33.97 56.2,34.92 53.34,34.92 | 53.34,34.92 53.02,34.92 52.07,33.97 R31.1
N$6
  Bottom 0.406: 9.37,6.51 arc180 9.37,9.21 8.41,9.21 arc180 8.41,6.51 9.37,6.51
N$7  (via drill 1 pad 2.54)
  Top 0.61: v14.61,38.73 C8.+ | v14.61,38.73 C8.+ | 6.99,42.23 11.11,42.23 v14.61,38.73 | v14.61,38.73 C8.+ | 2.54,42.55 X1.+ 2.54,42.23 | 2.54,42.55 2.54,42.23 | 2.54,42.55 IC6.IN | 2.54,42.23 6.99,42.23 | 6.99,42.23 C9.1 | v14.61,38.73 C8.+
N$8
  Bottom 0.406: 9.53,7.3 9.53,8.41 arc90 8.26,7.3
N$9
  Bottom 0.254: 7.94,8.41 7.94,8.26 8.1,8.41 7.94,8.41
N$17
  Bottom 0.406: 10.21,14.55 J22.1 10.14,14.59 10.16,14.61 10.21,14.55 | 10.21,14.55 9.74,14.55 | 10.21,14.55 10.9,14.55 13.81,17.46 J17.P$2 13.76,18.05
N$31
  Top 0.61: J1.P$1 5.08,28.57 5.08,35.56 X1.AC1
N$35
  Top 0.254: J3.19 93.98,42.23 R2.5
N$56
  Bottom 0.406: J12.1 50.16,14.92 | 50.16,14.92 J12_2.4 | R22.2 46.99,18.1 50.16,14.92
N$57
  Bottom 0.406: J12.3 45.09,14.92 | 45.09,14.92 J12_2.5 | 45.09,14.92 45.09,18.1 R21.2
N$59
  Top 0.406: IC4.7 34.92,24.45 40.01,24.45 R19.2
N$60
  Bottom 0.406: J13.1 29.84,14.92 | 29.84,14.92 J13_2.4 | 29.84,14.92 26.67,18.1 R20.2
N$61
  Bottom 0.406: D2.P$2 R20.1 33.02,20 IC4.2
N$62
  Top 0.61: J1.P$2 X1.AC2
N$64
  Bottom 0.406: 90.81,14.92 90.81,18.1 R27.2 | J20.1 90.81,14.92 | 90.81,14.92 J20_2.4
N$65
  Bottom 0.406: 85.72,14.92 87.63,16.83 R26.2 | J20.3 85.72,14.92 | 85.72,14.92 J20_2.5
N$67
  Bottom 0.305: IC5.7 57.47,27.94 68.26,27.94 R24.2
N$68
  Bottom 0.305: R25.1 D3.P$2 63.5,26.35 IC5.2
N$69
  Top 0.406: IC5.3 60.33,20.64 62.87,20.64 D3.P$1
  Bottom 0.406: 64.77,14.92 65.41,14.29 J21.3 | 64.77,14.92 J21_2.5 | 64.77,14.92 D3.P$1
N$70
  Bottom 0.406: J21.1 70.48,14.92 | 70.48,14.92 J21_2.4 | R25.2 67.31,18.1 70.48,14.92
N$72
  Top 0.406: R13.1 31.75,55.88 T1.2
N$73
  Bottom 0.61: P1.A 16.51,47.94 | 16.51,47.94 P1.S | R13.2 19.37,58.74 16.51,55.88 16.51,47.94
N$74
  Top 0.406: J15A.13 18.41,75.56 18.41,65.41 | 18.41,65.41 J15B.13 | 18.41,65.41 18.41,55.24 P2.S
N$83
  Top 0.254: J3.17 93.98,44.77 R2.4
N$84
  Bottom 0.254: R2.3 89.53,47.62 94.3,52.39 J3.11
NRST  (via drill 0.5)
  Top 0.254: IC1.7 71.87,48.78 v72.07,48.58
  Bottom 0.254: v72.07,48.58 74.61,46.04 84.77,46.04 87.63,43.18 87.63,39.69 88.58,38.73 R1.1 90.81,38.73 91.95,39.88 91.95,45.28 J3.15
PA0
  Top 0.254: J5B.4 58.42,69.85 58.42,65.09 61.59,61.91 64.77,61.91 66.67,60.01 66.67,54.93 66.99,54.61 68.37,53.23 IC1.14
PA1
  Top 0.254: IC1.15 67.87,52.78 66.04,54.61 66.04,59.69 64.45,61.28 61.28,61.28 57.78,64.77 57.78,67.94 J5B.6
PA2
  Top 0.254: IC1.16 67.37,52.33 65.72,53.98 65.41,54.29 65.41,59.37 64.14,60.64 60.96,60.64 57.15,64.45 57.15,66.04 J5B.8
PA3
  Top 0.254: IC1.17 65.42,49.83 65.09,49.85 64.77,50.16 64.77,59.05 63.82,60.01 60.64,60.01 J5B.10
PA4
  Top 0.254: R30.4 45.72,49.21 J16.10 46.99,53.98 46.99,55.88 50.16,59.05 57.47,59.05 59.37,57.15 59.37,52.58 63.66,48.29 IC1.20
PA5
  Top 0.254: R30.3 48.26,49.21 J16.8 J16.7 48.26,55.56 51.12,58.42 57.15,58.42 58.86,56.71 58.86,52.32 63.4,47.79 IC1.21
PA6
  Top 0.254: J16.5 50.8,55.56 53.02,57.78 56.83,57.78 58.17,56.45 58.17,52.26 63.14,47.29 IC1.22
PA7
  Top 0.254: R30.2 50.8,49.21 J16.6 52.07,53.98 52.07,55.88 53.34,57.15 56.52,57.15 57.47,56.2 57.47,52.07 58.86,50.8 62.88,46.79 IC1.23
PA8  (via drill 0.5)
  Top 0.254: v30.8,28.57 45.72,28.57 46.04,28.89 65.41,28.89 71.37,34.86 IC1.41
  Bottom 0.254: v30.8,28.57 28.57,30.8 28.57,35.56 IC2.11
PA9
  Top 0.254: R21.1 46.35,28.26 65.72,28.26 71.87,34.41 IC1.42 71.87,42.02 72.39,42.55 74.93,42.55 80.64,36.83 87.63,36.83 89.53,34.92 91.12,34.92 J11.8
PA10
  Top 0.254: R18.1 50.8,27.62 66.04,27.62 72.37,33.95 IC1.43 72.37,41.57 72.71,41.91 74.61,41.91 80.33,36.2 87.31,36.2 J11.6
  Bottom 0.254: IC4.6 37.47,24.45 47.62,24.45 R18.1
PA11
  Top 0.254: IC1.44 72.87,33.49 72.39,33.02 R10.2
PA12
  Top 0.254: IC1.45 73.37,34.58 77.47,30.48 R9.2
PA13
  Top 0.254: J3.7 95.57,56.52 97.47,56.52 98.42,55.56 98.42,34.92 95.89,32.38 76.83,32.38 73.87,35.35 IC1.46
PA14
  Top 0.254: J3.9 95.57,53.98 95.57,40.96 94.93,40.32 79.38,40.32 77.47,42.23 77.41,42.29 IC1.49
  Bottom 0.254: J3.9
PA15
  Top 0.254: J3.5 93.03,59.05 93.03,46.99 92.08,46.04 88.9,46.04 87.63,44.77 87.63,41.91 86.68,40.96 79.69,40.96 78.11,42.55 77.86,42.79 IC1.50
PB0
  Top 0.254: J5C.8 47.94,65.72 47.94,61.59 39.05,52.7 39.05,46.99 40.76,45.29 IC1.26
PB1
  Top 0.254: J5C.10 46.35,60.96 38.42,53.02 38.42,46.67 40.3,44.79 IC1.27
PB2  (via drill 0.5)  (1 unrouted)
  Top 0.254: J15A.11 20.95,75.56 20.95,71.12 R33.4 | R33.4 J15B.11 R33.4 | IC1.28 39.53,44.29 v38.1,45.72 37.47,46.35 37.47,53.02 40.96,56.52 40.96,65.41
  Bottom 0.254: v38.1,45.72 33.66,45.72 IC2.13
  Bottom 0.305: R33.4 24.13,71.75 32.38,71.75 J27.P$2
PB3  (via drill 0.5)  (1 unrouted)
  Top 0.254: IC1.55 85.61,45.29 88.9,48.58 90.01,48.58 90.33,48.26 | 90.33,48.26 | 90.33,48.26 90.65,47.94 v92.08,47.94
  Bottom 0.254: v92.08,47.94 | v92.08,47.94 J3.13
PB4  (1 unrouted)
  Top 0.254: IC1.56 85.16,45.79 88.27,48.9 88.27,53.02 91.12,55.88 91.12,59.69 J3.3
PB5
  Top 0.254: J19.6 78.11,73.03 R32.2 78.11,68.9 79.06,67.94 81.6,67.94 87.95,61.59 87.95,55.88 87.63,55.56 87.63,49.21 84.7,46.29 IC1.57
PB6
  Top 0.254: IC1.58 84.25,46.79 87,49.53 87,55.88 87.31,56.2 87.31,61.28 81.28,67.31 76.2,67.31 75.56,67.94 R32.3 75.56,73.03 J19.8 J19.7
PB7  (via drill 0.5)
  Top 0.254: IC1.59 83.8,47.29 86.36,49.85 86.36,56.2 86.68,56.52 86.68,60.64 v81.28,66.04
  Bottom 0.254: v81.28,66.04 79.38,67.94 79.38,71.75 78.11,73.03 78.11,75.56 J19.5
PB8  (via drill 0.5)
  Top 0.254: IC1.61 82.26,48.29 v82.87,48.9 | D1.A R11.1 | R11.1 J18.P$2 R11.1
  Bottom 0.254: v82.87,48.9 82.87,51.75 D1.A
PB9
  Top 0.254: IC1.62 81.49,48.79 83.19,50.48 D1.C
PB10
  Top 0.254: IC1.29 37.44,43.79 R7.1 37.47,43.81 37.47,44.77 35.56,46.67 J4.2
PB11
  Top 0.254: IC1.30 63.61,43.29 61.91,41.59 59.69,41.59 57.99,43.29 39.48,43.29 R8.1 36.83,40.64 34.92,40.64 33.97,41.59 33.97,47.94 J4.3
PB12
  Top 0.254: 67.37,41.02 IC1.33 67.37,38.16 66.36,37.15 62.36,37.15 57.47,42.04 47.75,42.04 J9/J8.9 45.72,38.1 J9/J8.10 44.45,36.2 R31.4
PB13
  Top 0.254: IC1.34 67.87,37.71 66.67,36.51 62.1,36.51 57.21,41.4 49.72,41.4 48.26,39.94 | R31.3 46.99,36.2 J9/J8.8 48.26,39.94 | 48.26,39.94 J9/J8.7
PB14
  Top 0.254: IC1.35 68.37,37.32 66.99,35.94 61.85,35.94 58.93,38.86 52.07,38.86 50.8,40.13 J9/J8.5
PB15
  Top 0.254: IC1.36 68.87,37.12 66.99,35.24 50.8,35.24 | R31.2 49.53,33.97 50.8,35.24 | 50.8,35.24 J9/J8.6
PC0
  Top 0.254: IC1.8 71.37,66.42 J5A.4
PC1
  Top 0.254: IC1.9 70.87,64.39 J5A.6
PC2
  Top 0.254: IC1.10 70.37,62.34 J5A.8
PC3
  Top 0.254: IC1.11 69.87,60.3 J5A.10
PC4
  Top 0.254: IC1.24 41.66,46.29 40.32,47.62 40.32,52.07 49.21,60.96 49.21,69.53 J5C.4
PC5
  Top 0.254: J5C.6 48.58,67.63 48.58,61.28 39.69,52.39 39.69,47.31 41.21,45.79 IC1.25
PC6
  Top 0.254: IC1.37 69.37,36.67 64.14,31.43 25.72,31.43 23.18,33.97 23.18,48.9 22.23,49.85 J15B.12 22.23,63.5 23.5,64.77 23.5,68.58 R33.5
PC7
  Top 0.254: IC1.38 69.87,36.22 64.45,30.8 25.4,30.8 22.54,33.66 22.54,48.58 21.59,49.53 21.59,60.96 20.95,61.59 20.95,68.58 R33.3
  Bottom 0.254: R33.3 19.68,71.75 J15A.12
PC8  (via drill 0.5)
  Top 0.254: IC1.39 70.37,35.76 64.77,30.16 25.08,30.16 21.59,33.66 v21.59,48.26 20.95,48.9 20.95,60.33 19.68,61.59 J15B.14
  Bottom 0.254: J15A.14 17.14,71.75 R33.2 17.14,67.31 18.41,66.04 18.41,64.14 J15B.14
  Bottom 0.305: v21.59,48.26 27.62,48.26 28.89,46.99 IC2.14
PC9  (via drill 0.5)
  Top 0.254: IC1.40 70.87,35.31 65.09,29.53 29.21,29.53 v28.26,28.57
  Bottom 0.254: v28.26,28.57 27.62,28.57 26.99,29.21 26.99,36.51 IC2.12
PC10  (via drill 0.5)
  Top 0.254: R26.1 J11.7 | IC1.51 78.31,43.29 79.06,42.55 82.87,42.55 v84.45,44.13
  Bottom 0.254: v84.45,44.13 86.36,42.23 86.36,39.05 91.12,34.29 91.12,32.38 J11.7
PC11  (via drill 0.5)
  Top 0.254: IC5.6 60.33,24.45 83.19,24.45 R23.1 | IC1.52 78.77,43.79 79.38,43.18 81.28,43.18 v82.23,44.13
  Bottom 0.254: 88.58,29.84 88.58,31.11 J11.5 | 88.58,29.84 88.58,35.24 85.09,38.73 85.09,41.27 v82.23,44.13 | R23.1 88.58,29.84
PC12  (via drill 0.5)
  Top 0.254: 29.21,59.69 J15B.4 33.66,64.14 | J15A.4 32.38,72.87 33.18,72.07 33.18,69.22 33.66,68.74 33.66,64.14 | 29.21,59.69 33.66,64.14 | 29.21,59.69 29.21,41.27 IC2.7 29.21,32.38 v39.69,32.38 | IC1.53 71.28,44.29 v70.48,43.5
  Bottom 0.254: v70.48,43.5 67.63,40.64 67.63,32.38 64.45,29.21 54.93,29.21 53.34,30.8 41.27,30.8 v39.69,32.38
PC13
  Top 0.254: IC1.2 74.37,53.1 75.56,54.29 78.74,54.29 80.01,55.56 80.01,65.41 78.74,66.67 75.88,66.67 74.3,68.26 J19.10 74.37,74.22
  Bottom 0.254: R32.5 70.48,70.48 J19.10
PC14
  Top 0.254: IC1.3 73.87,53.55 75.25,54.93 78.42,54.93 79.38,55.88 79.38,65.09 78.42,66.04 75.56,66.04 73.03,68.58 R32.4 | R32.4 73.23,69.64 | R32.4 73.03,75.56 J19.9
PC15  (via drill 0.5)
  Top 0.254: IC1.4 73.37,48.29 66.67,41.59 66.67,38.42 66.04,37.78 62.55,37.78 57.78,42.55 47.31,42.55 46.67,41.91 42.55,41.91 v42.07,42.39 | J16.9 41.91,51.44 R30.5
  Bottom 0.254: R30.5 41.91,42.55 v42.07,42.39
PD0
  Top 0.254: IC1.5 72.87,53.66 74.3,56.84 74.3,56.83 | 74.3,56.83 C1.1 | 74.3,56.83 Q1.2
PD1
  Top 0.254: IC1.6 72.37,57.13 72.39,57.15 74.3,63.02 | C2.1 76.36,64.29 75.09,63.82 74.3,63.02 | 74.3,63.02 Q1.1
PD2  (via drill 0.5)
  Top 0.254: IC1.54 79.36,44.79 v80.01,44.13
  Bottom 0.254: v80.01,44.13 83.82,40.32 83.82,37.47 82.55,36.2 R15.2
S$1
  pour Top (isolate 0.254): 0,80.01 100.01,80.01 100.01,0 0,0
USB1
  Top 0.406: R10.1 70.64,16.99 19.53,16.99 18.89,16.35 9.37,16.35 7.62,14.61 7.64,14.59 J22.2
USB2
  Top 0.406: J22.3 7.64,10.78 14.29,4.13 70.8,4.13 72.39,5.71 72.39,11.75 76.2,15.56 76.2,18.73 R9.1 R14.1

### Text on the board
tPlace: Vs | V0 | RW | D0 | D2 | D4 | D6 | B+ | Vd | RC2 | SC | SI | 5V | Vs | Vd | Vs | Vd | Vs | Vs | Vs | A8 | Vs | A4 | Vs | A0 | RC1 | SC | SO | 5V | Vs | 5V | RS | E | D1 | D3 | D5 | D7 | B- | Vs | A9 | Vs | A5 | Vs | A1 | A10 | Vs | Vs | A6 | Vs | A2 | 3.3V | 3.3V | 3.3V | 3.3V | Sel | Sel | Sel | Sel | 5V | 5V | 5V | 5V | Vs | V0 | RW | D0 | D2 | D4 | D6 | B+ | Vs | A11 | Vs | A7 | Vs | A3 | 3.3V | 3.3V | TRST | Vs | 5V | RS | E | D1 | D3 | D5 | D7 | B- | CAN | CAN | CAN | CAN | TDI | Vs | RC2 | SC | SI | Vd | Vs | TMS | Vs | TCK | Vs | 5V | RT | Vs | SD | RC1 | SC | SO | Vd | Vs | TDO | Vs | SC | 3.3V | 3.3V | 3.3V | 3.3V | Sel | Sel | Sel | Sel | 5V | 5V | 5V | 5V | Vs | Vs | have fun! | have fun! | have fun! | have fun! | RQ | Vs | RC | SC | SI | Vd | Vs | ACK | RC | SC | SO | Vd | Vs | Vs | Vs | MI1 | 5V | 3.3V | 3.3V | 3.3V | 3.3V | Sel | Sel | Sel | Sel | 5V | 5V | 5V | 5V | Vs | Vs | MI2 | MO2 | 5V | (c) midibox.org | (c) midibox.org | (c) midibox.org | (c) midibox.org | +5V | USB | POWER | OPTION | Vs | M+ | M- | M+ | Vs | Vs | M- | M+ | M- | M+ | M+ | Vs | M-
tNames: 1 | 1 | 1 | 1 | J9 | J8 | MBHP_CORE | MBHP_CORE | MBHP_CORE | MBHP_CORE | STM32_V2a | STM32_V2a | STM32_V2a | STM32_V2a | IN1 | IN1 | IN1 | IN1 | OUT1 | OUT1 | OUT1 | OUT1 | IN2 | IN2 | IN2 | IN2 | OUT2 | OUT2 | OUT2 | OUT2 | USB | USB | USB | USB
_tsilk: Vs | Vs | Vs | Vs | V0 | V0 | V0 | V0 | RW | RW | RW | RW | D0 | D0 | D0 | D0 | D2 | D2 | D2 | D2 | D4 | D4 | D4 | D4 | D6 | D6 | D6 | D6 | B+ | B+ | B+ | B+ | J5C | J5B | J5A | RC2 | RC2 | RC2 | RC2 | SC | SC | SC | SC | SI | SI | SI | SI | 5V | 5V | 5V | 5V | Vs | Vs | Vs | Vs | Vd | Vd | Vd | Vd | Vs | Vs | Vs | Vs | Vd | Vd | Vd | Vd | Vs | Vs | Vs | Vs | Vd | Vs | Vs | Vs | Vs | J15A | J15A | Vs | Vs | Vs | Vs | A8 | A8 | A8 | A8 | Vs | Vs | Vs | Vs | A4 | A4 | A4 | A4 | Vs | Vs | Vs | Vs | A0 | A0 | A0 | A0 | J19 | RC1 | RC1 | RC1 | RC1 | SC | SC | SC | SC | SO | SO | SO | SO | 5V | 5V | 5V | 5V | Vs | Vs | Vs | Vs | R33 | 5V | 5V | 5V | 5V | RS | RS | RS | RS | E | E | E | E | D1 | D1 | D1 | D1 | D3 | D3 | D3 | D3 | J27 | D5 | D5 | D5 | D5 | D7 | D7 | D7 | D7 | B- | B- | B- | B- | C12 | Vs | Vs | Vs | Vs | A9 | A9 | A9 | A9 | Vs | Vs | Vs | Vs | A5 | A5 | A5 | A5 | Vs | Vs | Vs | Vs | A1 | A1 | A1 | A1 | J3 | A10 | A10 | A10 | A10 | Vs | Vs | Vs | Vs | Vs | Vs | Vs | Vs | A6 | A6 | A6 | A6 | Vs | Vs | Vs | Vs | A2 | A2 | A2 | A2 | R32 | 3.3V | 3.3V | 3.3V | 3.3V | Sel | Sel | Sel | Sel | 5V | 5V | 5V | 5V | Vs | Vs | Vs | Vs | V0 | V0 | V0 | V0 | RW | RW | RW | RW | D0 | D0 | D0 | D0 | D2 | D2 | D2 | D2 | D4 | D4 | D4 | D4 | D6 | D6 | D6 | D6 | B+ | B+ | B+ | B+ | J3 | J15B | Vs | Vs | Vs | Vs | A11 | A11 | A11 | A11 | Vs | Vs | Vs | Vs | A7 | A7 | A7 | A7 | Vs | Vs | Vs | Vs | A3 | A3 | A3 | A3 | C2 | IC7 | C13 | 3.3V | 3.3V | TRST | TRST | TRST | TRST | J15B | Q1 | Vs | Vs | Vs | Vs | T1 | 5V | RS | E | D1 | D1 | D1 | D1 | D3 | D3 | D3 | D3 | D5 | D5 | D5 | D5 | D7 | D7 | D7 | D7 | B- | B- | B- | B- | J18 | CAN | CAN | CAN | CAN | R11 | TDI | TDI | TDI | TDI | Vs | Vs | Vs | Vs | P2 | J5C | J5B | J5A | C10 | RC2 | RC2 | RC2 | RC2 | SC | SC | SC | SC | SI | SI | SI | SI | Vd | Vd | Vd | Vd | Vs | Vs | Vs | Vs | J23 | TMS | TMS | TMS | TMS | Vs | Vs | Vs | Vs | R13 | R12 | C3 | TCK | TCK | TCK | TCK | J4 | C17 | C1 | Vs | Vs | Vs | Vs | IC6 | 5V | 5V | 5V | 5V | J16 | RT | RT | RT | RT | Vs | Vs | Vs | Vs | SD | SD | SD | SD | RC1 | RC1 | RC1 | RC1 | SC | SC | SC | SC | SO | SO | SO | SO | Vd | Vd | Vd | Vd | Vs | Vs | Vs | Vs | C6 | 1 | 1 | 1 | 1 | D1 | J16 | P1 | C5 | TDO | TDO | TDO | TDO | Vs | Vs | Vs | Vs | SC | SC | SC | SC | 3.3V | 3.3V | 3.3V | 3.3V | Sel | Sel | Sel | Sel | 5V | 5V | 5V | 5V | R2 | Vs | Vs | Vs | Vs | R30 | IC1 | C16 | Vs | Vs | Vs | Vs | have fun! | have fun! | have fun! | have fun! | RQ | RQ | RQ | RQ | Vs | Vs | Vs | Vs | IC2 | J9 | C9 | C11 | RC | RC | RC | RC | SC | SC | SC | SC | SI | SI | SI | SI | Vd | Vd | Vd | Vd | Vs | Vs | Vs | Vs | Vs | Vs | Vs | Vs | R7 | R8 | J9 | J9 | J9 | J9 | ACK | ACK | ACK | ACK | J8 | J8 | J8 | J8 | C7 | R1 | J8 | ~ | RC | RC | RC | RC | SC | SC | SC | SC | SO | SO | SO | SO | Vd | Vd | Vd | Vd | Vs | Vs | Vs | Vs | C4 | X1 | C8 | Vs | Vs | Vs | Vs | Vs | Vs | Vs | Vs | MI1 | MI1 | MI1 | MI1 | MO1 | MO1 | MO1 | MO1 | 5V | 5V | 5V | 5V | C14 | J11 | ~ | MBHP_CORE | MBHP_CORE | MBHP_CORE | MBHP_CORE | R31 | 3.3V | 3.3V | 3.3V | 3.3V | Sel | Sel | Sel | Sel | 5V | 5V | 5V | 5V | J11 | STM32_V2a | Vs | Vs | Vs | Vs | Vs | Vs | Vs | Vs | MI2 | MI2 | MI2 | MI2 | MO2 | MO2 | MO2 | MO2 | 5V | 5V | 5V | 5V | J1 | (c) midibox.org | (c) midibox.org | (c) midibox.org | (c) midibox.org | AC/DC | INPUT | J2 | R15 | +5V | +5V | +5V | +5V | IC4 | IC5 | J17 | D2 | R20 | R19 | R21 | R22 | R18 | D3 | R25 | R24 | R10 | R14 | R9 | LED1 | R23 | R26 | R27 | USB | USB | USB | USB | POWER | POWER | POWER | POWER | OPTION | OPTION | OPTION | OPTION | Vs | Vs | Vs | Vs | IN1 | IN1 | IN1 | IN1 | OUT1 | OUT1 | OUT1 | OUT1 | IN2 | IN2 | IN2 | IN2 | OUT2 | OUT2 | OUT2 | OUT2 | J22 | USB | USB | USB | USB | M+ | M+ | M+ | M+ | M- | M- | M- | M- | M+ | M+ | M+ | M+ | Vs | Vs | Vs | Vs | M- | M- | M- | M- | M+ | M+ | M+ | M+ | M- | M- | M- | M- | M+ | M+ | M+ | M+ | Vs | Vs | Vs | Vs | M- | M- | M- | M-